# Altium project ArduinoMegaDevBoard.PrjPcb
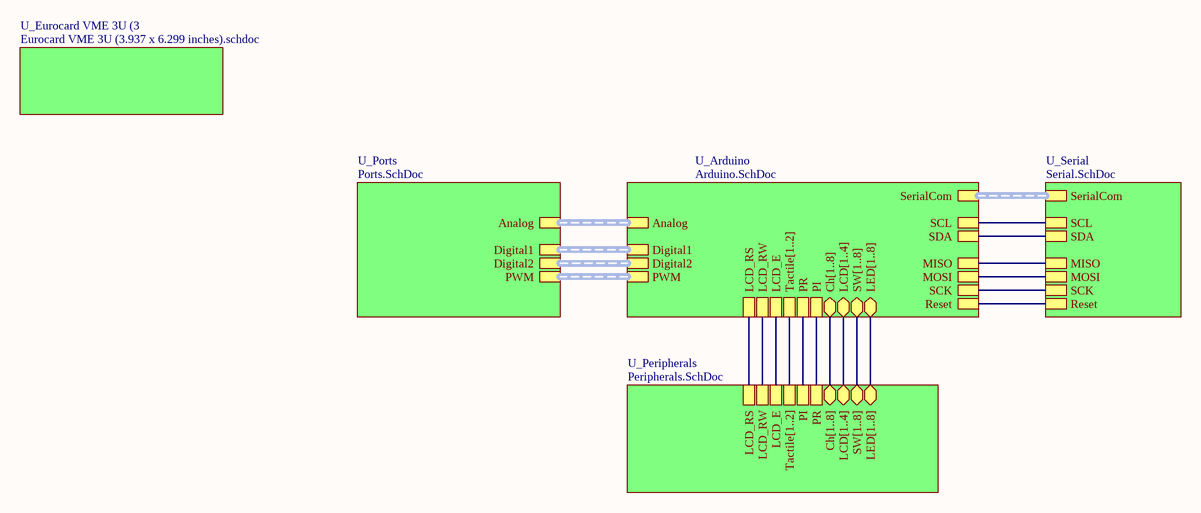
[diagram p0: TopSheet.SchDoc]
5 sheets, 92 parts. Net scope: hierarchical (ports join the sheet entries above them; power ports are global).
Board file: Eurocard VME 3U (3.937 x 6.299 inches).PCBDOC
Sheets:
  TopSheet.SchDoc
    U_Arduino = Arduino.SchDoc
    U_Serial = Serial.SchDoc
    U_Peripherals = Peripherals.SchDoc
    U_Ports = Ports.SchDoc

## Sheet TopSheet.SchDoc
size A4

### Sub-sheets
U_Arduino = Arduino.SchDoc: SerialCom (harness SerialMC), LED[1..8] (bidir), SW[1..8] (bidir), LCD[1..4] (bidir), PR, PI, Ch[1..8] (bidir), Reset, SCK, MISO, MOSI, Tactile[1..2], Digital1 (harness Digital1), Digital2 (harness Digital2), PWM (harness PWM), Analog (harness Analog1), SCL, SDA, LCD_E, LCD_RW, LCD_RS
U_Eurocard VME 3U (3 = Eurocard VME 3U (3.937 x 6.299 inches).schdoc (file not in this document): no entries
U_Peripherals = Peripherals.SchDoc: LED[1..8] (bidir), SW[1..8] (bidir), LCD[1..4] (bidir), PI, PR, Ch[1..8] (bidir), Tactile[1..2], LCD_E, LCD_RW, LCD_RS
U_Ports = Ports.SchDoc: PWM, Digital1, Digital2, Analog (harness Analog1Port)
U_Serial = Serial.SchDoc: SerialCom (harness Serial3), MISO, Reset, SCK, MOSI, SCL, SDA

### Nets
LCD2: sheet U_Arduino/SCK, sheet U_Serial/SCK
LCD3: sheet U_Arduino/MOSI, sheet U_Serial/MOSI
LCD4: sheet U_Arduino/MISO, sheet U_Serial/MISO
LCD RS: sheet U_Arduino/LCD_RS, sheet U_Peripherals/LCD_RS
LCD RW: sheet U_Arduino/LCD_RW, sheet U_Peripherals/LCD_RW
LCD_E: sheet U_Arduino/LCD_E, sheet U_Peripherals/LCD_E
PI: sheet U_Arduino/PI, sheet U_Peripherals/PR
PR: sheet U_Arduino/PR, sheet U_Peripherals/PI
Reset: sheet U_Arduino/Reset, sheet U_Serial/Reset
SCL: sheet U_Arduino/SCL, sheet U_Serial/SCL
SDA: sheet U_Arduino/SDA, sheet U_Serial/SDA

### Buses and harness runs
bus sheet U_Arduino/Ch[1..8] = sheet U_Peripherals/Ch[1..8]
bus sheet U_Arduino/LCD[1..4] = sheet U_Peripherals/LCD[1..4]
bus sheet U_Arduino/LED[1..8] = sheet U_Peripherals/LED[1..8]
bus sheet U_Arduino/SW[1..8] = sheet U_Peripherals/SW[1..8]
bus sheet U_Arduino/Tactile[1..2] = sheet U_Peripherals/Tactile[1..2]
harness sheet U_Arduino/Analog = sheet U_Ports/Analog
harness sheet U_Arduino/Digital1 = sheet U_Ports/Digital1
harness sheet U_Arduino/Digital2 = sheet U_Ports/Digital2
harness sheet U_Arduino/PWM = sheet U_Ports/PWM
harness sheet U_Arduino/SerialCom = sheet U_Serial/SerialCom

## Sheet Arduino.SchDoc
size A4
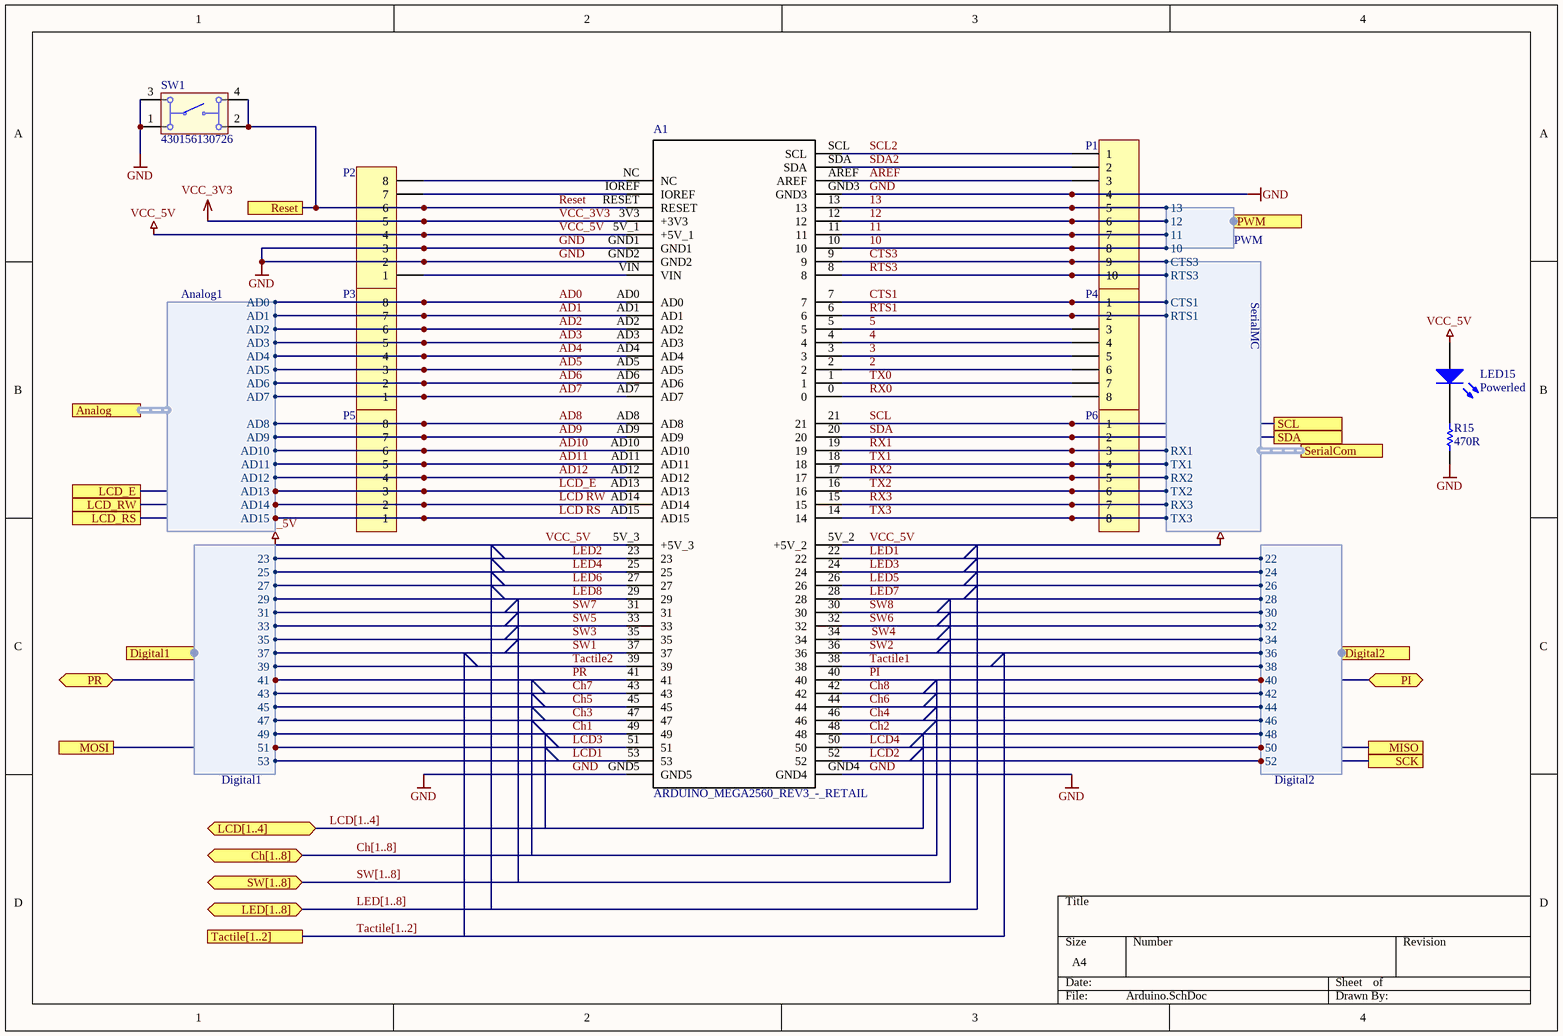
[diagram p1: Arduino.SchDoc]

### Parts
A1  ARDUINO_MEGA2560_REV3_-_RETAIL  [*ARDUINO_MEGA2560_REV3_-_RETAIL_ARDUINO_MEGA2560_REV3_-_RETAIL(Primary)]
LED15  Powerled  [1206_A]
P1  Header 10  [HDR1X10]  (value not drawn)
P2  Header 8  [HDR1X8]  (value not drawn)
P3  Header 8  [HDR1X8]  (value not drawn)
P4  Header 8  [HDR1X8]  (value not drawn)
P5  Header 8  [HDR1X8]  (value not drawn)
P6  Header 8  [HDR1X8]  (value not drawn)
R15  470R  [RESC0805(2012)_M]
SW1  430156130726  [430156130726]

### Ports
Analog (harness Analog1), Ch[1..8] (bidir), Digital1 (harness Digital1), Digital2 (harness Digital2), LCD[1..4] (bidir), LCD_E, LCD_RS, LCD_RW, LED[1..8] (bidir), MISO, MOSI, PI (bidir), PR (bidir), PWM (harness PWM), Reset, SCK, SCL, SDA, SerialCom (harness SerialMC), SW[1..8] (bidir), Tactile[1..2]

### Harnesses
SerialMC: TX3, RX3, TX2, RX2, TX1, CTS3, RTS3, CTS1, RTS1, RX1
Analog1: AD0, AD1, AD2, AD3, AD4, AD5, AD6, AD7, AD8, AD9, AD10, AD11, AD12, AD13, AD14, AD15
Digital1: 23, 25, 27, 29, 31, 33, 35, 37, 39, 41, 43, 45, 47, 49, 51, 53
Digital2: 22, 24, 26, 28, 30, 32, 34, 36, 38, 40, 42, 44, 46, 48, 50, 52
PWM: 10, 11, 12, 13

### Nets
GND: A1.GND1 A1.GND2 A1.GND3 A1.GND4 A1.GND5 P1.4 P2.2 P2.3 R15.1 SW1.1 SW1.3
VCC_3V3: A1.3V3(+3V3) P2.5
VCC_5V: A1.5V_1(+5V_1) A1.5V_2(+5V_2) A1.5V_3(+5V_3) LED15.2(A) P2.4
2: A1.2 P4.6
3: A1.3 P4.5
4: A1.4 P4.4
5: A1.5 P4.3
10: A1.10 P1.8 ; port PWM.10
11: A1.11 P1.7 ; port PWM.11
12: A1.12 P1.6 ; port PWM.12
13: A1.13 P1.5 ; port PWM.13
AD0: A1.AD0 P3.8 ; port Analog.AD0
AD1: A1.AD1 P3.7 ; port Analog.AD1
AD2: A1.AD2 P3.6 ; port Analog.AD2
AD3: A1.AD3 P3.5 ; port Analog.AD3
AD4: A1.AD4 P3.4 ; port Analog.AD4
AD5: A1.AD5 P3.3 ; port Analog.AD5
AD6: A1.AD6 P3.2 ; port Analog.AD6
AD7: A1.AD7 P3.1 ; port Analog.AD7
AD8: A1.AD8 P5.8 ; port Analog.AD8
AD9: A1.AD9 P5.7 ; port Analog.AD9
AD10: A1.AD10 P5.6 ; port Analog.AD10
AD11: A1.AD11 P5.5 ; port Analog.AD11
AD12: A1.AD12 P5.4 ; port Analog.AD12
AREF: A1.AREF P1.3
Ch1: A1.49 ; port Digital1.49
Ch2: A1.48 ; port Digital2.48
Ch3: A1.47 ; port Digital1.47
Ch4: A1.46 ; port Digital2.46
Ch5: A1.45 ; port Digital1.45
Ch6: A1.44 ; port Digital2.44
Ch7: A1.43 ; port Digital1.43
Ch8: A1.42 ; port Digital2.42
CTS1: A1.7 P4.1 ; port SerialCom.CTS1
CTS3: A1.9 P1.9 ; port SerialCom.CTS3
LCD1: A1.53 ; port Digital1.53
LCD2: A1.52 ; port SCK, port Digital2.52
LCD3: A1.51 ; port MOSI, port Digital1.51
LCD4: A1.50 ; port MISO, port Digital2.50
LCD RS: A1.AD15 P5.1 ; port LCD_RS, port Analog.AD15
LCD RW: A1.AD14 P5.2 ; port LCD_RW, port Analog.AD14
LCD_E: A1.AD13 P5.3 ; port LCD_E, port Analog.AD13
LED1: A1.22 ; port Digital2.22
LED2: A1.23 ; port Digital1.23
LED3: A1.24 ; port Digital2.24
LED4: A1.25 ; port Digital1.25
LED5: A1.26 ; port Digital2.26
LED6: A1.27 ; port Digital1.27
LED7: A1.28 ; port Digital2.28
LED8: A1.29 ; port Digital1.29
PI: A1.40 ; port PI, port Digital2.40
PR: A1.41 ; port PR, port Digital1.41
Reset: A1.RESET P2.6 SW1.2 SW1.4 ; port Reset
RTS1: A1.6 P4.2 ; port SerialCom.RTS1
RTS3: A1.8 P1.10 ; port SerialCom.RTS3
RX0: A1.0 P4.8
RX1: A1.19 P6.3 ; port SerialCom.RX1
RX2: A1.17 P6.5 ; port SerialCom.RX2
RX3: A1.15 P6.7 ; port SerialCom.RX3
SCL: A1.21 P6.1 ; port SCL
SCL2: A1.SCL P1.1
SDA: A1.20 P6.2 ; port SDA
SDA2: A1.SDA P1.2
SW1: A1.37 ; port Digital1.37
SW2: A1.36 ; port Digital2.36
SW3: A1.35 ; port Digital1.35
SW4: A1.34 ; port Digital2.34
SW5: A1.33 ; port Digital1.33
SW6: A1.32 ; port Digital2.32
SW7: A1.31 ; port Digital1.31
SW8: A1.30 ; port Digital2.30
Tactile1: A1.38 ; port Digital2.38
Tactile2: A1.39 ; port Digital1.39
TX0: A1.1 P4.7
TX1: A1.18 P6.4 ; port SerialCom.TX1
TX2: A1.16 P6.6 ; port SerialCom.TX2
TX3: A1.14 P6.8 ; port SerialCom.TX3
NetA1_IOREF: A1.IOREF P2.7
NetA1_NC: A1.NC P2.8
NetA1_VIN: A1.VIN P2.1
NetLED15_1: LED15.1(K) R15.2

### Buses and harness runs
bus Ch[1..8] = port Ch[1..8]
bus LCD[1..4] = port LCD[1..4]
bus LED[1..8] =  = port LED[1..8]
bus SW[1..8] = port SW[1..8]
bus Tactile[1..2] = port Tactile[1..2]

### Library data of the parts
A1 = ARDUINO_MEGA2560_REV3_-_RETAIL: Dev.kit: Arduino; SPI, TWI, UART; ICSP, USB B, pin strips, supply; MP: ARDUINO MEGA2560 REV3 - RETAIL; Price: None; MF: Arduino; Package: None; Availability: Unavailable; SnapEDA_Link: https://www.snapeda.com/parts/ARDUINO%20MEGA2560%20REV3%20-%20RETAIL/Arduino/view-part/?ref=snap; Value: *
LED15 = CMP-1426-00013-1: SMD mono-color Chip LED, WL-SMCW, Red; PartNumber: 150120RS75000; Manufacturer: Wuerth Elektronik; Color: Red; ComponentLink2URL: http://katalog.we-online.com/led/datasheet/150120RS75000.pdf; ComponentLink2Description: Datasheet; ComponentLink1Description: Manufacturer URL; ComponentLink1URL: http://www.we-online.com; PackageReference: 1206_A
P1 = Header 10: Header, 10-Pin; LatestRevisionDate: 17-Jul-2002; LatestRevisionNote: Re-released for DXP Platform.; Publisher: Altium Limited
P2-P6 = Header 8: Header, 8-Pin; LatestRevisionDate: 17-Jul-2002; LatestRevisionNote: Re-released for DXP Platform.; Publisher: Altium Limited
R15 = CMP-1013-00473-1: 470R 0.125W 1% 0805 (2012 Metric)  SMD; Case-Metric: 2012; Value: 470.00 Ohm; Case-EIA: 0805; Power: 0.125 W; Technology: SMT; Tolerance: 1 %
SW1 = CMP-1453-00009-1: WS-TATV THT Tact Switch 6X6 mm; Manufacturer: Wuerth Elektronik; NoPins: 04; PartNumber: 430156130726; ComponentLink1Description: Manufacturer URL; ComponentLink1URL: http://www.we-online.com; ComponentLink2Description: Datasheet; ComponentLink2URL: http://katalog.we-online.de/em/datasheet/4301x6.pdf; PackageReference: 430156130726

## Sheet Serial.SchDoc
size A4
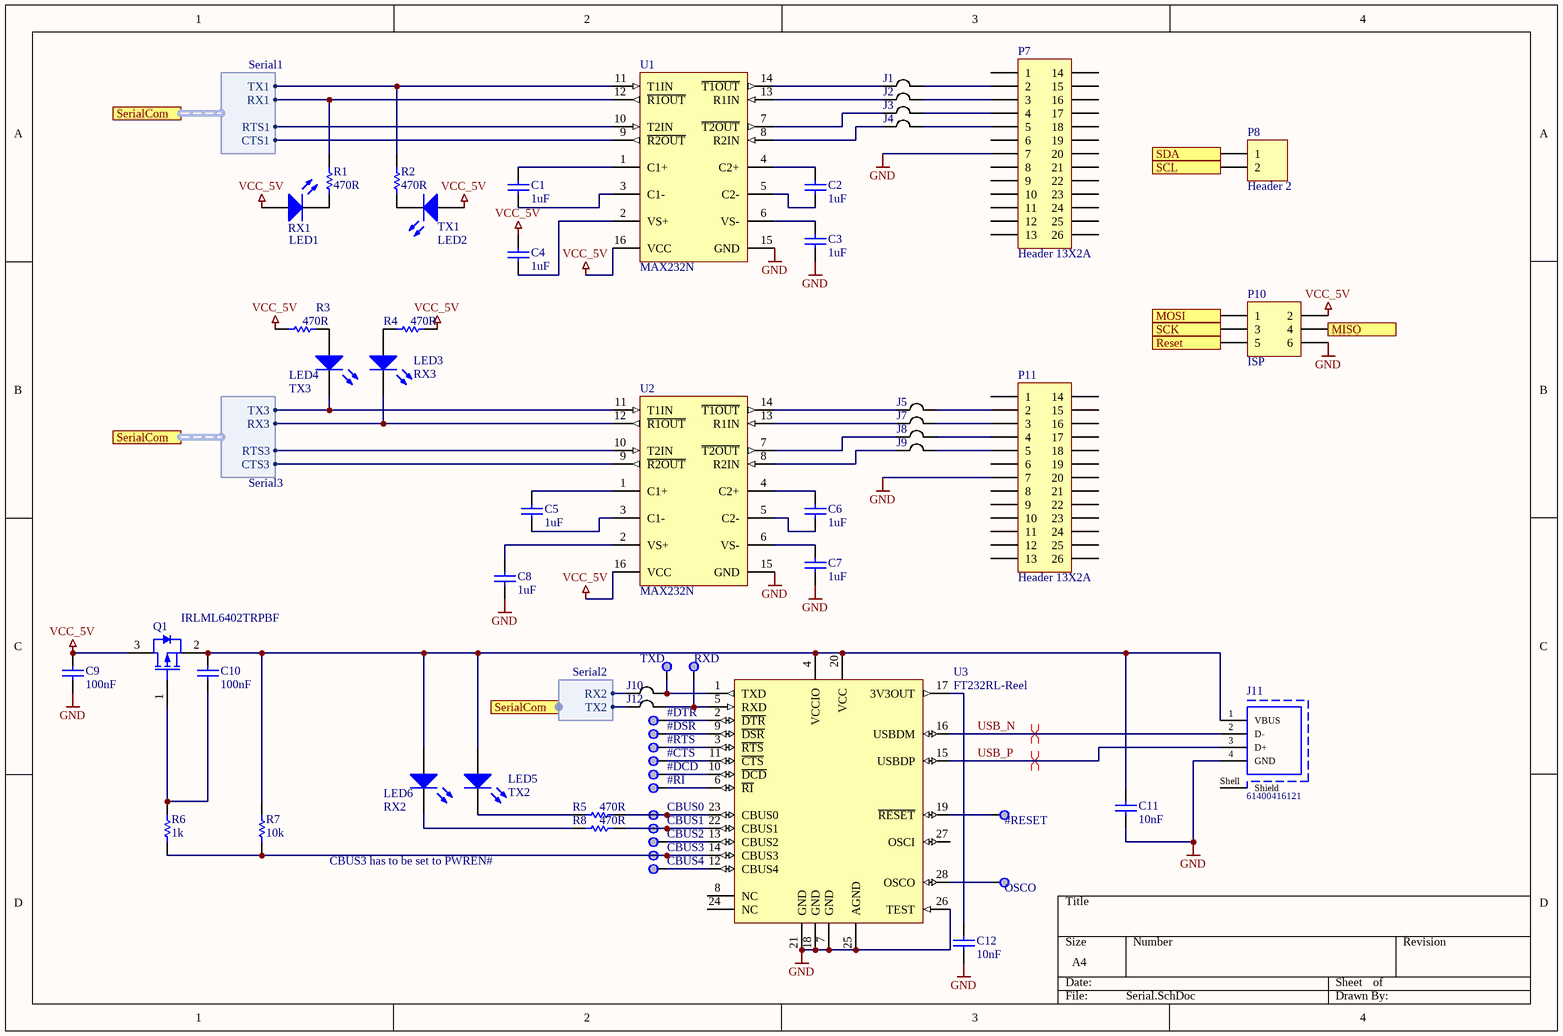
[diagram p2: Serial.SchDoc]

### Parts
#CTS  Testpunkt  [Testpunkt]  (value not drawn)
#DCD  Testpunkt  [Testpunkt]  (value not drawn)
#DSR  Testpunkt  [Testpunkt]  (value not drawn)
#DTR  Testpunkt  [Testpunkt]  (value not drawn)
#RESET  Testpunkt  [Testpunkt]  (value not drawn)
#RI  Testpunkt  [Testpunkt]  (value not drawn)
#RTS  Testpunkt  [Testpunkt]  (value not drawn)
C1  1uF  [CAPC0805(2012)100_M]
C2  1uF  [CAPC0805(2012)100_M]
C3  1uF  [CAPC0805(2012)100_M]
C4  1uF  [CAPC0805(2012)100_M]
C5  1uF  [CAPC0805(2012)100_M]
C6  1uF  [CAPC0805(2012)100_M]
C7  1uF  [CAPC0805(2012)100_M]
C8  1uF  [CAPC0805(2012)100_M]
C9  100nF  [CAPC0805(2012)100_M]
C10  100nF  [CAPC0805(2012)100_M]
C11  10nF  [CAPC0805(2012)100_M]
C12  10nF  [CAPC0805(2012)100_M]
CBUS0  Testpunkt  [Testpunkt]  (value not drawn)
CBUS1  Testpunkt  [Testpunkt]  (value not drawn)
CBUS2  Testpunkt  [Testpunkt]  (value not drawn)
CBUS3  Testpunkt  [Testpunkt]  (value not drawn)
CBUS4  Testpunkt  [Testpunkt]  (value not drawn)
J1  Jumper  [SMDJumper]  (value not drawn)
J2  Jumper  [SMDJumper]  (value not drawn)
J3  Jumper  [SMDJumper]  (value not drawn)
J4  Jumper  [SMDJumper]  (value not drawn)
J5  Jumper  [SMDJumper]  (value not drawn)
J7  Jumper  [SMDJumper]  (value not drawn)
J8  Jumper  [SMDJumper]  (value not drawn)
J9  Jumper  [SMDJumper]  (value not drawn)
J10  Jumper  [SMDJumper]  (value not drawn)
J11  61400416121  [61400416121]
J12  Jumper  [SMDJumper]  (value not drawn)
LED1  RX1  [1206_A]
LED2  TX1  [1206_A]
LED3  RX3  [1206_A]
LED4  TX3  [1206_A]
LED5  TX2  [1206_A]
LED6  RX2  [1206_A]
OSCO  Testpunkt  [Testpunkt]  (value not drawn)
P7  Header 13X2A  [HDR2X13_CEN]
P8  Header 2  [HDR1X2]
P10  ISP  [HDR2X3]
P11  Header 13X2A  [HDR2X13_CEN]
Q1  IRLML6402TRPBF  [INTR-SOT-23-3_V]
R1  470R  [RESC0805(2012)_M]
R2  470R  [RESC0805(2012)_M]
R3  470R  [RESC0805(2012)_M]
R4  470R  [RESC0805(2012)_M]
R5  470R  [RESC0805(2012)_M]
R6  1k  [RESC0805(2012)_M]
R7  10k  [RESC0805(2012)_M]
R8  470R  [RESC0805(2012)_M]
RXD  Testpunkt  [Testpunkt]  (value not drawn)
TXD  Testpunkt  [Testpunkt]  (value not drawn)
U1  MAX232N  [N0016A]
U2  MAX232N  [N0016A]
U3  FT232RL-Reel  [SSOP-28_M]

### Ports
MISO, MOSI, Reset, SCK, SCL, SDA, SerialCom (harness Serial1), SerialCom (harness Serial2), SerialCom (harness Serial3)

### Harnesses
Serial1: TX1, RX1, CTS1, RTS1
Serial2: TX2, RX2
Serial3: TX3, RX3, CTS3, RTS3

### Nets
GND: C3.2 C7.2 C8.2 C9.2 C11.2 C12.2 J11.4(GND) P7.7 P10.6 P11.7 U1.15(GND) U2.15(GND) U3.7(GND) U3.18(GND) U3.21(GND) U3.25(AGND) U3.26(TEST)
VCC_5V: C4.1 C9.1 LED1.2(A) LED2.2(A) P10.2 Q1.3(DRAIN) R3.1 R4.2 U1.16(VCC) U2.16(VCC)
CTS1: U1.9(~{R2OUT}) ; port SerialCom.CTS1
CTS3: U2.9(~{R2OUT}) ; port SerialCom.CTS3
LCD2: P10.3 ; port SCK
LCD3: P10.1 ; port MOSI
LCD4: P10.4 ; port MISO
Reset: P10.5 ; port Reset
RTS1: U1.10(T2IN) ; port SerialCom.RTS1
RTS3: U2.10(T2IN) ; port SerialCom.RTS3
RX1: R1.2 U1.12(~{R1OUT}) ; port SerialCom.RX1
RX2: J10.1 ; port SerialCom.RX2
RX3: LED3.1(K) U2.12(~{R1OUT}) ; port SerialCom.RX3
SCL: P8.2 ; port SCL
SDA: P8.1 ; port SDA
TX1: R2.2 U1.11(T1IN) ; port SerialCom.TX1
TX2: J12.1 ; port SerialCom.TX2
TX3: LED4.1(K) U2.11(T1IN) ; port SerialCom.TX3
USB_N: J11.2(D-) U3.16(USBDM)
USB_P: J11.3(D+) U3.15(USBDP)
Net#CTS_1: #CTS.1 U3.11(~{CTS})
Net#DCD_1: #DCD.1 U3.10(~{DCD})
Net#DSR_1: #DSR.1 U3.9(~{DSR})
Net#DTR_1: #DTR.1 U3.2(~{DTR})
Net#RESET_1: #RESET.1 U3.19(~{RESET})
Net#RI_1: #RI.1 U3.6(~{RI})
Net#RTS_1: #RTS.1 U3.3(~{RTS})
NetC1_1: C1.1 U1.1(C1+)
NetC1_2: C1.2 U1.3(C1-)
NetC2_1: C2.1 U1.4(C2+)
NetC2_2: C2.2 U1.5(C2-)
NetC3_1: C3.1 U1.6(VS-)
NetC4_2: C4.2 U1.2(VS+)
NetC5_1: C5.1 U2.1(C1+)
NetC5_2: C5.2 U2.3(C1-)
NetC6_1: C6.1 U2.4(C2+)
NetC6_2: C6.2 U2.5(C2-)
NetC7_1: C7.1 U2.6(VS-)
NetC8_1: C8.1 U2.2(VS+)
NetC10_1: C10.1 C11.1 J11.1(VBUS) LED5.2(A) LED6.2(A) Q1.2(SOURCE) R7.2 U3.4(VCCIO) U3.20(VCC)
NetC10_2: C10.2 Q1.1(GATE) R6.2
NetC12_1: C12.1 U3.17(3V3OUT)
NetCBUS0_1: CBUS0.1 R5.2 U3.23(CBUS0)
NetCBUS1_1: CBUS1.1 R8.2 U3.22(CBUS1)
NetCBUS2_1: CBUS2.1 U3.13(CBUS2)
NetCBUS3_1: CBUS3.1 R6.1 R7.1 U3.14(CBUS3)
NetCBUS4_1: CBUS4.1 U3.12(CBUS4)
NetJ1_1: J1.1 U1.14(~{T1OUT})
NetJ1_2: J1.2 P7.2
NetJ2_1: J2.1 U1.13(R1IN)
NetJ2_2: J2.2 P7.3
NetJ3_1: J3.1 U1.7(~{T2OUT})
NetJ3_2: J3.2 P7.4
NetJ4_1: J4.1 U1.8(R2IN)
NetJ4_2: J4.2 P7.5
NetJ5_1: J5.1 U2.14(~{T1OUT})
NetJ5_2: J5.2 P11.2
NetJ7_1: J7.1 U2.13(R1IN)
NetJ7_2: J7.2 P11.3
NetJ8_1: J8.1 U2.7(~{T2OUT})
NetJ8_2: J8.2 P11.4
NetJ9_1: J9.1 U2.8(R2IN)
NetJ9_2: J9.2 P11.5
NetJ10_2: J10.2 TXD.1 U3.1(TXD)
NetJ12_2: J12.2 RXD.1 U3.5(RXD)
NetLED1_1: LED1.1(K) R1.1
NetLED2_1: LED2.1(K) R2.1
NetLED3_2: LED3.2(A) R4.1
NetLED4_2: LED4.2(A) R3.2
NetLED5_1: LED5.1(K) R5.1
NetLED6_1: LED6.1(K) R8.1
NetOSCO_1: OSCO.1 U3.28(OSCO)

Not connected (* = marked no-connect by the designer): J11 Shell(Shield); P7 1 6 8 9 10 11 12 13 14 15 16 17 18 19 20 21 22 23 24 25 26; P11 1 6 8 9 10 11 12 13 14 15 16 17 18 19 20 21 22 23 24 25 26; U3 8(NC) 24(NC) 27(OSCI)

### Layout directives
differential pair; net class USB_N: USB_N
differential pair: USB_P

### Notes on the sheet
- CBUS3 has to be set to PWREN#

### Library data of the parts
C1-C8 = CMP-1036-04754-1: CAP 1uF 25V ±10% 0805 (2012 Metric) Thickness 1mm SMD; Case-EIA: 0805; Case-Metric: 2012; Tolerance: Â±10%; Max Thickness: 1 mm; Value: 1uF; Rated Voltage: 25 V; Technology: SMT
C9 C10 = CMP-1036-04754-1: CAP 100nF 25V ±10% 0805 (2012 Metric) Thickness 1mm SMD; Case-EIA: 0805; Case-Metric: 2012; Tolerance: Â±10%; Max Thickness: 1 mm; Value: 100nF; Rated Voltage: 25 V; Technology: SMT
C11 C12 = CMP-1036-04754-1: CAP 10nF 25V ±10% 0805 (2012 Metric) Thickness 1mm SMD; Case-EIA: 0805; Case-Metric: 2012; Tolerance: Â±10%; Max Thickness: 1 mm; Value: 10nF; Rated Voltage: 25 V; Technology: SMT
J11 = CMP-1502-03243-1: USB 2.0 Type B Receptacle WR-COM, Horizontal, THT, with Pads and Pegs; Manufacturer: Wurth Elektronik; Contact Resistance: 20mOhm; Rated Current: 1.5A; Working Voltage: 30VAC; Package Reference: 61400416121; Part Number: 61400416121; Packaging: Tray; Mounting Technology: THT; Gender: Receptacle; Datasheet URL: https://katalog.we-online.de/em/datasheet/61400416121.pdf; Publisher: WurthElektronik; Orientation: Horizontal; Connector Type: USB2.0TypeB; Operating Temperature: -40to105degC; Manufacturer URL: http://www.we-online.de
LED1-LED6 = CMP-1426-00013-1: as LED15 on sheet Arduino; Color: Red; ComponentLink2URL: http://katalog.we-online.com/led/datasheet/150120RS75000.pdf; ComponentLink2Description: Datasheet; ComponentLink1Description: Manufacturer URL; ComponentLink1URL: http://www.we-online.com; PackageReference: 1206_A
P7 P11 = Header 13X2A: Header, 13-Pin, Dual row; LatestRevisionDate: 17-Jul-2002; LatestRevisionNote: Re-released for DXP Platform.; Publisher: Altium Limited
P8 = Header 2: Header, 2-Pin; LatestRevisionDate: 17-Jul-2002; LatestRevisionNote: Re-released for DXP Platform.; Publisher: Altium Limited
P10 = Header 3X2: Header, 3-Pin, Dual row; LatestRevisionDate: 17-Jul-2002; LatestRevisionNote: Re-released for DXP Platform.; Publisher: Altium Limited
Q1 = CMP-2000-04987-1: HEXFET(R) Power P-Channel MOSFET, -20 V, -3.7 A, -55 to 150 degC, 3-Pin SOT-23, RoHS, Tape and Reel; Manufacturer: International Rectifier; Drain-to-Source Voltage [Vdss]: 20V; Rated Power Dissipation: 1.3W; Qg Gate Charge: 8nC; Drain-Source On Resistance-Max: 0.065O; Channel Type: P-Channel; Package Reference: SOT-23-3; Manufacturer URL: http://internationalrectifier.com/; Datasheet URL: http://datasheet.octopart.com/IRLML6402TRPBF-International-Rectifier-datasheet-93882.pdf; Datasheet Version: Feb-05; Package Description: 3-Pin Small Outline Transistor, Body 2.92 x 1.3 mm, Pitch 0.95 mm
R1-R5 R8 = CMP-1013-00473-1: as R15 on sheet Arduino; Power: 0.125 W; Technology: SMT; Tolerance: 1 %
R6 = CMP-1013-00473-1: 1k 0.125W 1% 0805 (2012 Metric)  SMD; Case-Metric: 2012; Case-EIA: 0805; Power: 0.125 W; Value: 1k; Technology: SMT; Tolerance: 1 %
R7 = CMP-1013-00473-1: 10k 0.125W 1% 0805 (2012 Metric)  SMD; Case-Metric: 2012; Case-EIA: 0805; Power: 0.125 W; Value: 10k; Technology: SMT; Tolerance: 1 %
U1 U2 = CMP-0299-00084-2: Dual EIA-232 Driver / Receiver, 0 to 70 degC, 16-Pin PDIP (N), Pb-Free (RoHS); Single Supply: TRUE; ICC(Max)(mA): 10; SubFamily: RS-232; Supply Voltage(s)(V): 5; ESD HBM(kV): +/-2; Receivers Per Package: 2; ComponentLink1Description: Manufacturer URL; PackageDescription: 16-Pin Plastic Dual-In-Line Package, Row Spacing 7.62 mm, Pitch 2.54 mm; ComponentLink3Description: Package Specification; DatasheetVersion: SLLS047L; ComponentLink2URL: http://www.ti.com/general/docs/lit/getliterature.tsp?genericPartNumber=MAX232&fileType=pdf; RS-232: TRUE; ComponentLink3URL: http://www.ti.com/litv/pdf/mpdi002c; PackageReference: N0016A; PackageVersion: revE, Dec-2002; ComponentLink1URL: www.ti.com; Drivers Per Package: 2; ComponentLink2Description: Datasheet
U3 = CMP-0078-00029-3: USB UART Asynchronous Serial Data Transfer Chip, 28-pin SSOP, Tape and Reel; Manufacturer: FTDI; PackageVersion: Mar-12; PackageReference: SSOP-28; ComponentLink2Description: Datasheet; DatasheetVersion: ver 2.10, Mar-2012; PackageDescription: 28-Pin Small Outline Package 0.65 mm Pitch; ComponentLink1Description: Manufacturer URL; RevisionNote: DatasheetVersion updated to 2.10 Mar-2012; PartNumber: FT232RL-Reel; ComponentLink1URL: http://www.ftdichip.com/; ComponentLink2URL: http://www.ftdichip.com/Support/Documents/DataSheets/ICs/DS_FT232R.pdf

## Sheet Peripherals.SchDoc
size A4
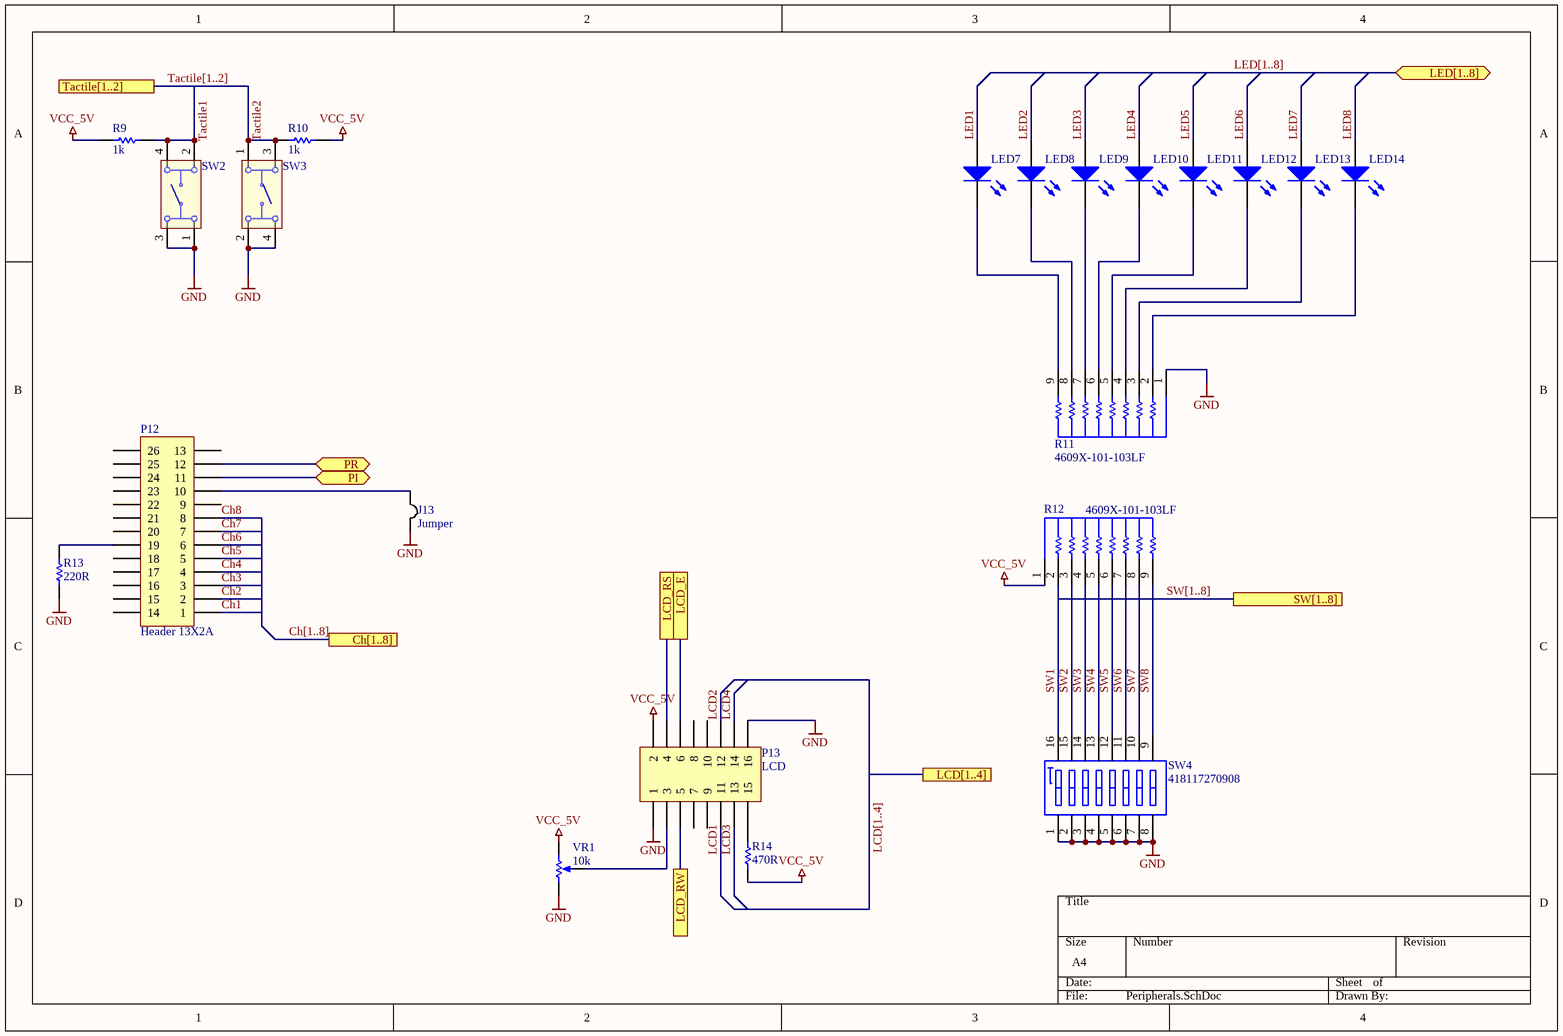
[diagram p3: Peripherals.SchDoc]

### Parts
J13  Jumper  [SMDJumper]
LED7  TX1  [Type 3mm]  (value not drawn)
LED8  TX1  [Type 3mm]  (value not drawn)
LED9  TX1  [Type 3mm]  (value not drawn)
LED10  TX1  [Type 3mm]  (value not drawn)
LED11  TX1  [Type 3mm]  (value not drawn)
LED12  TX1  [Type 3mm]  (value not drawn)
LED13  TX1  [Type 3mm]  (value not drawn)
LED14  TX1  [Type 3mm]  (value not drawn)
P12  Header 13X2A  [HDR2X13_CEN]
P13  LCD  [HDR2X8]
R9  1k  [RESC0805(2012)_M]
R10  1k  [RESC0805(2012)_M]
R11  4609X-101-103LF  [BOUR-4609X]
R12  4609X-101-103LF  [BOUR-4609X]
R13  220R  [RESC0805(2012)_M]
R14  470R  [RESC0805(2012)_M]
SW2  430156130726  [430156130726]  (value not drawn)
SW3  430156130726  [430156130726]  (value not drawn)
SW4  418117270908  [418117270908]
VR1  10k  [BOUR-3362P]

### Ports
Ch[1..8], LCD[1..4], LCD_E, LCD_RS, LCD_RW, LED[1..8] (bidir), PI (bidir), PR (bidir), SW[1..8], Tactile[1..2]

### Nets
GND: J13.2 P13.1 P13.16 R11.1 R13.1 SW2.1 SW2.3 SW3.2 SW3.4 SW4.1 SW4.2 SW4.3 SW4.4 SW4.5 SW4.6 SW4.7 SW4.8 VR1.1(CCW)
VCC_5V: P13.2 R9.2 R10.1 R12.1 R14.1 VR1.3(CW)
Ch1: P12.1
Ch2: P12.2
Ch3: P12.3
Ch4: P12.4
Ch5: P12.5
Ch6: P12.6
Ch7: P12.7
Ch8: P12.8
LCD1: P13.11
LCD2: P13.12
LCD3: P13.13
LCD4: P13.14
LCD RS: P13.4 ; port LCD_RS
LCD RW: P13.5 ; port LCD_RW
LCD_E: P13.6 ; port LCD_E
LED1: LED7.2(A)
LED2: LED8.2(A)
LED3: LED9.2(A)
LED4: LED10.2(A)
LED5: LED11.2(A)
LED6: LED12.2(A)
LED7: LED13.2(A)
LED8: LED14.2(A)
PI: P12.12 ; port PR
PR: P12.11 ; port PI
SW1: R12.2 SW4.16
SW2: R12.3 SW4.15
SW3: R12.4 SW4.14
SW4: R12.5 SW4.13
SW5: R12.6 SW4.12
SW6: R12.7 SW4.11
SW7: R12.8 SW4.10
SW8: R12.9 SW4.9
Tactile1: R9.1 SW2.2 SW2.4
Tactile2: R10.2 SW3.1 SW3.3
NetJ13_1: J13.1 P12.10
NetLED7_1: LED7.1(K) R11.9
NetLED8_1: LED8.1(K) R11.8
NetLED9_1: LED9.1(K) R11.7
NetLED10_1: LED10.1(K) R11.6
NetLED11_1: LED11.1(K) R11.5
NetLED12_1: LED12.1(K) R11.4
NetLED13_1: LED13.1(K) R11.3
NetLED14_1: LED14.1(K) R11.2
NetP12_19: P12.19 R13.2
NetP13_3: P13.3 VR1.2(S)
NetP13_15: P13.15 R14.2

Not connected (* = marked no-connect by the designer): P12 9 13 14 15 16 17 18 20 21 22 23 24 25 26; P13 7 8 9 10

### Buses and harness runs
bus Ch[1..8] = port Ch[1..8]
bus LCD[1..4] = port LCD[1..4]
bus LED[1..8] = port LED[1..8]
bus SW[1..8] = port SW[1..8]
bus Tactile[1..2] = port Tactile[1..2]

### Library data of the parts
LED7-LED14 = CMP-1489-00003-1: THT LED round mono-color waterclear, WL-TMRW, Yellow; Manufacturer: Wuerth Elektronik; PartNumber: 151033YS03000; ComponentLink2Description: Datasheet; ComponentLink1Description: Manufacturer URL; Emitting color: Yellow; ComponentLink2URL: http://katalog.we-online.de/pbs/datasheet/7448042001.pdfhttp://katalog.we-online.de/pbs/datasheet/7448042001.pdfhttp://katalog.we-online.de/pbs/datasheet/7448042001.pdfhttp://katalog.we-online.de/pbs/datasheet/151033YS03000.pdf; ComponentLink1URL: http://www.we-online.com; PackageReference: Type 3mm
P12 = Header 13X2A: Header, 13-Pin, Dual row; LatestRevisionDate: 17-Jul-2002; LatestRevisionNote: Re-released for DXP Platform.; Publisher: Altium Limited
P13 = Header 8X2: Header, 8-Pin, Dual row; LatestRevisionDate: 17-Jul-2002; LatestRevisionNote: Re-released for DXP Platform.; Publisher: Altium Limited
R9 R10 = CMP-1013-00473-1: as R6 on sheet Serial; Power: 0.125 W; Value: 1k; Technology: SMT; Tolerance: 1 %
R11 R12 = CMP-2000-05605-1: Resistor, Network, 1.13 W, 10 kOhm, -55 to 125 degC, 9-Pin THD, RoHS, Bulk; Manufacturer: Bourns; Tolerance: ±2%; Power, Rating: 1.13W; Resistance: 10kilohms; Temperature, Operating: -55to+125°C; Brand/Series: 4600XSeries; Circuit: BussedArray; Number of Resistors: 8; Package Type: SIP; Dimensions: 0.898x0.098x0.2(22.81x2.49x5.08)LxWxHin.(mm); Package Reference: 4609X; Mounting Technology: ThroughHole; Package Description: 9-Pin Through Hole Device, Body 22.81 x 2.49 mm, Pitch 2.54 mm; Number of Terminals: 9; Datasheet URL: https://datasheet.ciiva.com/11807/0900766b8069ccfd-11807021.pdf; Datasheet Version: 04/2010; Manufacturer URL: http://www.bourns.com/; Mounting Type: ThroughHole
R13 = CMP-1013-00473-1: 220R 0.125W 1% 0805 (2012 Metric)  SMD; Case-Metric: 2012; Case-EIA: 0805; Power: 0.125 W; Value: 220R; Technology: SMT; Tolerance: 1 %
R14 = CMP-1013-00473-1: as R15 on sheet Arduino; Power: 0.125 W; Technology: SMT; Tolerance: 1 %
SW2 SW3 = CMP-1453-00009-1: as SW1 on sheet Arduino; PartNumber: 430156130726; ComponentLink1Description: Manufacturer URL; ComponentLink1URL: http://www.we-online.com; ComponentLink2Description: Datasheet; ComponentLink2URL: http://katalog.we-online.de/em/datasheet/4301x6.pdf; PackageReference: 430156130726
SW4 = CMP-1435-00007-1: WS-DITV 2.54 mm Compact THT Dip Switch with Raised Actuator; Manufacturer: Wuerth Elektronik; NoPins: 16; ComponentLink2URL: http://katalog.we-online.de/em/datasheet/4181172709xx.pdf; ComponentLink1Description: Manufacturer URL; ComponentLink1URL: http://www.we-online.com; ComponentLink2Description: Datasheet; PackageReference: 418117270908; PartNumber: 418117270908
VR1 = CMP-1747-00003-1: Square Trimpot(R) Trimming Potentiometer, 100 KOhm, 300 V, -55 to 125 degC, 3-Pin THD, RoHS, Tube; Voltage Rating: 250 V; Case\Package: Axial; Tolerance: 1%; Power Rating: 250 mW; Resistance: 1 mohm; RoHSCompliant: true; ComponentLink2URL: http://www.bourns.com/docs/Product-Datasheets/3362.pdf; ComponentLink1Description: Manufacturer URL; DatasheetVersion: May-16; Package Quantity: 200; ComponentLink2Description: Datasheet; Min Operating Temperature: -55 degC; Mount: Through Hole; PackageDescription: 3-Pin Through Hole Device, Body 6.6 x 6.99 mm, Pitch 2.54 mm; Length: 0.248 inch; ComponentLink1URL: http://www.bourns.com/; PackageReference: 3326P; Max Operating Temperature: 155 degC; Packaging: Bulk

## Sheet Ports.SchDoc
size A4
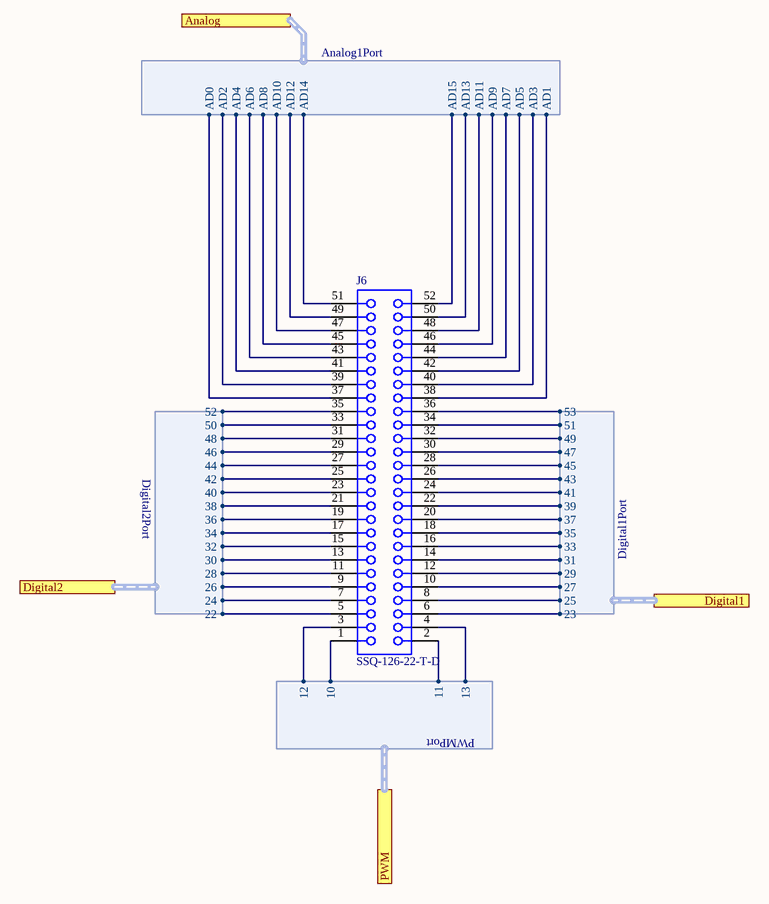
[diagram p4: Ports.SchDoc]

### Parts
J6  SSQ-126-22-T-D  [SMTC-SSQ-126-22-X-D]

### Ports
Analog (harness Analog1Port), Digital1 (harness Digital1Port), Digital2 (harness Digital2Port), PWM (harness PWMPort)

### Harnesses
Digital2Port: 22, 24, 26, 28, 30, 32, 34, 36, 38, 40, 42, 44, 46, 48, 50, 52
Digital1Port: 23, 25, 27, 29, 31, 33, 35, 37, 39, 41, 43, 45, 47, 49, 51, 53
PWMPort: 10, 11, 12, 13
Analog1Port: AD0, AD1, AD2, AD3, AD4, AD5, AD6, AD7, AD8, AD9, AD10, AD11, AD12, AD13, AD14, AD15

### Nets
10: J6.1 ; port PWM.10
11: J6.2 ; port PWM.11
12: J6.3 ; port PWM.12
13: J6.4 ; port PWM.13
AD0: J6.37 ; port Analog.AD0
AD1: J6.38 ; port Analog.AD1
AD2: J6.39 ; port Analog.AD2
AD3: J6.40 ; port Analog.AD3
AD4: J6.41 ; port Analog.AD4
AD5: J6.42 ; port Analog.AD5
AD6: J6.43 ; port Analog.AD6
AD7: J6.44 ; port Analog.AD7
AD8: J6.45 ; port Analog.AD8
AD9: J6.46 ; port Analog.AD9
AD10: J6.47 ; port Analog.AD10
AD11: J6.48 ; port Analog.AD11
AD12: J6.49 ; port Analog.AD12
Ch1: J6.32 ; port Digital1.49
Ch2: J6.31 ; port Digital2.48
Ch3: J6.30 ; port Digital1.47
Ch4: J6.29 ; port Digital2.46
Ch5: J6.28 ; port Digital1.45
Ch6: J6.27 ; port Digital2.44
Ch7: J6.26 ; port Digital1.43
Ch8: J6.25 ; port Digital2.42
LCD1: J6.36 ; port Digital1.53
LCD2: J6.35 ; port Digital2.52
LCD3: J6.34 ; port Digital1.51
LCD4: J6.33 ; port Digital2.50
LCD RS: J6.52 ; port Analog.AD15
LCD RW: J6.51 ; port Analog.AD14
LCD_E: J6.50 ; port Analog.AD13
LED1: J6.5 ; port Digital2.22
LED2: J6.6 ; port Digital1.23
LED3: J6.7 ; port Digital2.24
LED4: J6.8 ; port Digital1.25
LED5: J6.9 ; port Digital2.26
LED6: J6.10 ; port Digital1.27
LED7: J6.11 ; port Digital2.28
LED8: J6.12 ; port Digital1.29
PI: J6.23 ; port Digital2.40
PR: J6.24 ; port Digital1.41
SW1: J6.20 ; port Digital1.37
SW2: J6.19 ; port Digital2.36
SW3: J6.18 ; port Digital1.35
SW4: J6.17 ; port Digital2.34
SW5: J6.16 ; port Digital1.33
SW6: J6.15 ; port Digital2.32
SW7: J6.14 ; port Digital1.31
SW8: J6.13 ; port Digital2.30
Tactile1: J6.21 ; port Digital2.38
Tactile2: J6.22 ; port Digital1.39

### Library data of the parts
J6 = CMP-1023-00318-1: SQ Post Socket, Through-hole, Vertical, -55 to 105 degC, 2.54 mm Pitch, 52-Pin, Female, RoHS; Manufacturer: Samtec; Pitch: 2.54 mm; ComponentLink1Description: Manufacturer URL; PartNumber: SSQ-126-22-T-D; PackageDescription: Assembly, Socket Strip .025[0.64] SQ Tail; ComponentLink3Description: Package Specification; DatasheetVersion: F-214; ComponentLink2Description: Datasheet; PackageReference: SSQ-126-22-X-D; PackageVersion: BD, 6/1987; ComponentLink1URL: http://www.samtec.com; Mounting Technology: Through-hole; Orientation: Vertical; ComponentLink3URL: http://www.samtec.com/documents/webfiles/cpdf/SSQ-1XX-XX-XXX-X-XX-XXX-XX-X-MKT.pdf; Temperature Range: -55 to 105 degC; ComponentLink2URL: http://www.samtec.com/documents/webfiles/pdf/SSQ_TH.PDF; RoHS: True

## Nets that join several sheets
GND: Arduino (11 pins), Serial (17 pins), Peripherals (18 pins)
VCC_5V: Arduino (5 pins), Serial (10 pins), Peripherals (6 pins)
10: Arduino (A1.10 P1.8), Ports (J6.1)
11: Arduino (A1.11 P1.7), Ports (J6.2)
12: Arduino (A1.12 P1.6), Ports (J6.3)
13: Arduino (A1.13 P1.5), Ports (J6.4)
AD0: Arduino (A1.AD0 P3.8), Ports (J6.37)
AD1: Arduino (A1.AD1 P3.7), Ports (J6.38)
AD2: Arduino (A1.AD2 P3.6), Ports (J6.39)
AD3: Arduino (A1.AD3 P3.5), Ports (J6.40)
AD4: Arduino (A1.AD4 P3.4), Ports (J6.41)
AD5: Arduino (A1.AD5 P3.3), Ports (J6.42)
AD6: Arduino (A1.AD6 P3.2), Ports (J6.43)
AD7: Arduino (A1.AD7 P3.1), Ports (J6.44)
AD8: Arduino (A1.AD8 P5.8), Ports (J6.45)
AD9: Arduino (A1.AD9 P5.7), Ports (J6.46)
AD10: Arduino (A1.AD10 P5.6), Ports (J6.47)
AD11: Arduino (A1.AD11 P5.5), Ports (J6.48)
AD12: Arduino (A1.AD12 P5.4), Ports (J6.49)
Ch1: Arduino (A1.49), Peripherals (P12.1), Ports (J6.32)
Ch2: Arduino (A1.48), Peripherals (P12.2), Ports (J6.31)
Ch3: Arduino (A1.47), Peripherals (P12.3), Ports (J6.30)
Ch4: Arduino (A1.46), Peripherals (P12.4), Ports (J6.29)
Ch5: Arduino (A1.45), Peripherals (P12.5), Ports (J6.28)
Ch6: Arduino (A1.44), Peripherals (P12.6), Ports (J6.27)
Ch7: Arduino (A1.43), Peripherals (P12.7), Ports (J6.26)
Ch8: Arduino (A1.42), Peripherals (P12.8), Ports (J6.25)
CTS1: Arduino (A1.7 P4.1), Serial (U1.9)
CTS3: Arduino (A1.9 P1.9), Serial (U2.9)
LCD1: Arduino (A1.53), Peripherals (P13.11), Ports (J6.36)
LCD2: Arduino (A1.52), Serial (P10.3), Peripherals (P13.12), Ports (J6.35)
LCD3: Arduino (A1.51), Serial (P10.1), Peripherals (P13.13), Ports (J6.34)
LCD4: Arduino (A1.50), Serial (P10.4), Peripherals (P13.14), Ports (J6.33)
LCD RS: Arduino (A1.AD15 P5.1), Peripherals (P13.4), Ports (J6.52)
LCD RW: Arduino (A1.AD14 P5.2), Peripherals (P13.5), Ports (J6.51)
LCD_E: Arduino (A1.AD13 P5.3), Peripherals (P13.6), Ports (J6.50)
LED1: Arduino (A1.22), Peripherals (LED7.2), Ports (J6.5)
LED2: Arduino (A1.23), Peripherals (LED8.2), Ports (J6.6)
LED3: Arduino (A1.24), Peripherals (LED9.2), Ports (J6.7)
LED4: Arduino (A1.25), Peripherals (LED10.2), Ports (J6.8)
LED5: Arduino (A1.26), Peripherals (LED11.2), Ports (J6.9)
LED6: Arduino (A1.27), Peripherals (LED12.2), Ports (J6.10)
LED7: Arduino (A1.28), Peripherals (LED13.2), Ports (J6.11)
LED8: Arduino (A1.29), Peripherals (LED14.2), Ports (J6.12)
PI: Arduino (A1.40), Peripherals (P12.12), Ports (J6.23)
PR: Arduino (A1.41), Peripherals (P12.11), Ports (J6.24)
Reset: Arduino (A1.RESET P2.6 SW1.2 SW1.4), Serial (P10.5)
RTS1: Arduino (A1.6 P4.2), Serial (U1.10)
RTS3: Arduino (A1.8 P1.10), Serial (U2.10)
RX1: Arduino (A1.19 P6.3), Serial (R1.2 U1.12)
RX2: Arduino (A1.17 P6.5), Serial (J10.1)
RX3: Arduino (A1.15 P6.7), Serial (LED3.1 U2.12)
SCL: Arduino (A1.21 P6.1), Serial (P8.2)
SDA: Arduino (A1.20 P6.2), Serial (P8.1)
SW1: Arduino (A1.37), Peripherals (R12.2 SW4.16), Ports (J6.20)
SW2: Arduino (A1.36), Peripherals (R12.3 SW4.15), Ports (J6.19)
SW3: Arduino (A1.35), Peripherals (R12.4 SW4.14), Ports (J6.18)
SW4: Arduino (A1.34), Peripherals (R12.5 SW4.13), Ports (J6.17)
SW5: Arduino (A1.33), Peripherals (R12.6 SW4.12), Ports (J6.16)
SW6: Arduino (A1.32), Peripherals (R12.7 SW4.11), Ports (J6.15)
SW7: Arduino (A1.31), Peripherals (R12.8 SW4.10), Ports (J6.14)
SW8: Arduino (A1.30), Peripherals (R12.9 SW4.9), Ports (J6.13)
Tactile1: Arduino (A1.38), Peripherals (R9.1 SW2.2 SW2.4), Ports (J6.21)
Tactile2: Arduino (A1.39), Peripherals (R10.2 SW3.1 SW3.3), Ports (J6.22)
TX1: Arduino (A1.18 P6.4), Serial (R2.2 U1.11)
TX2: Arduino (A1.16 P6.6), Serial (J12.1)
TX3: Arduino (A1.14 P6.8), Serial (LED4.1 U2.11)